# Altium project CONTROLLER_30.PrjPcb (part 3 of 3)
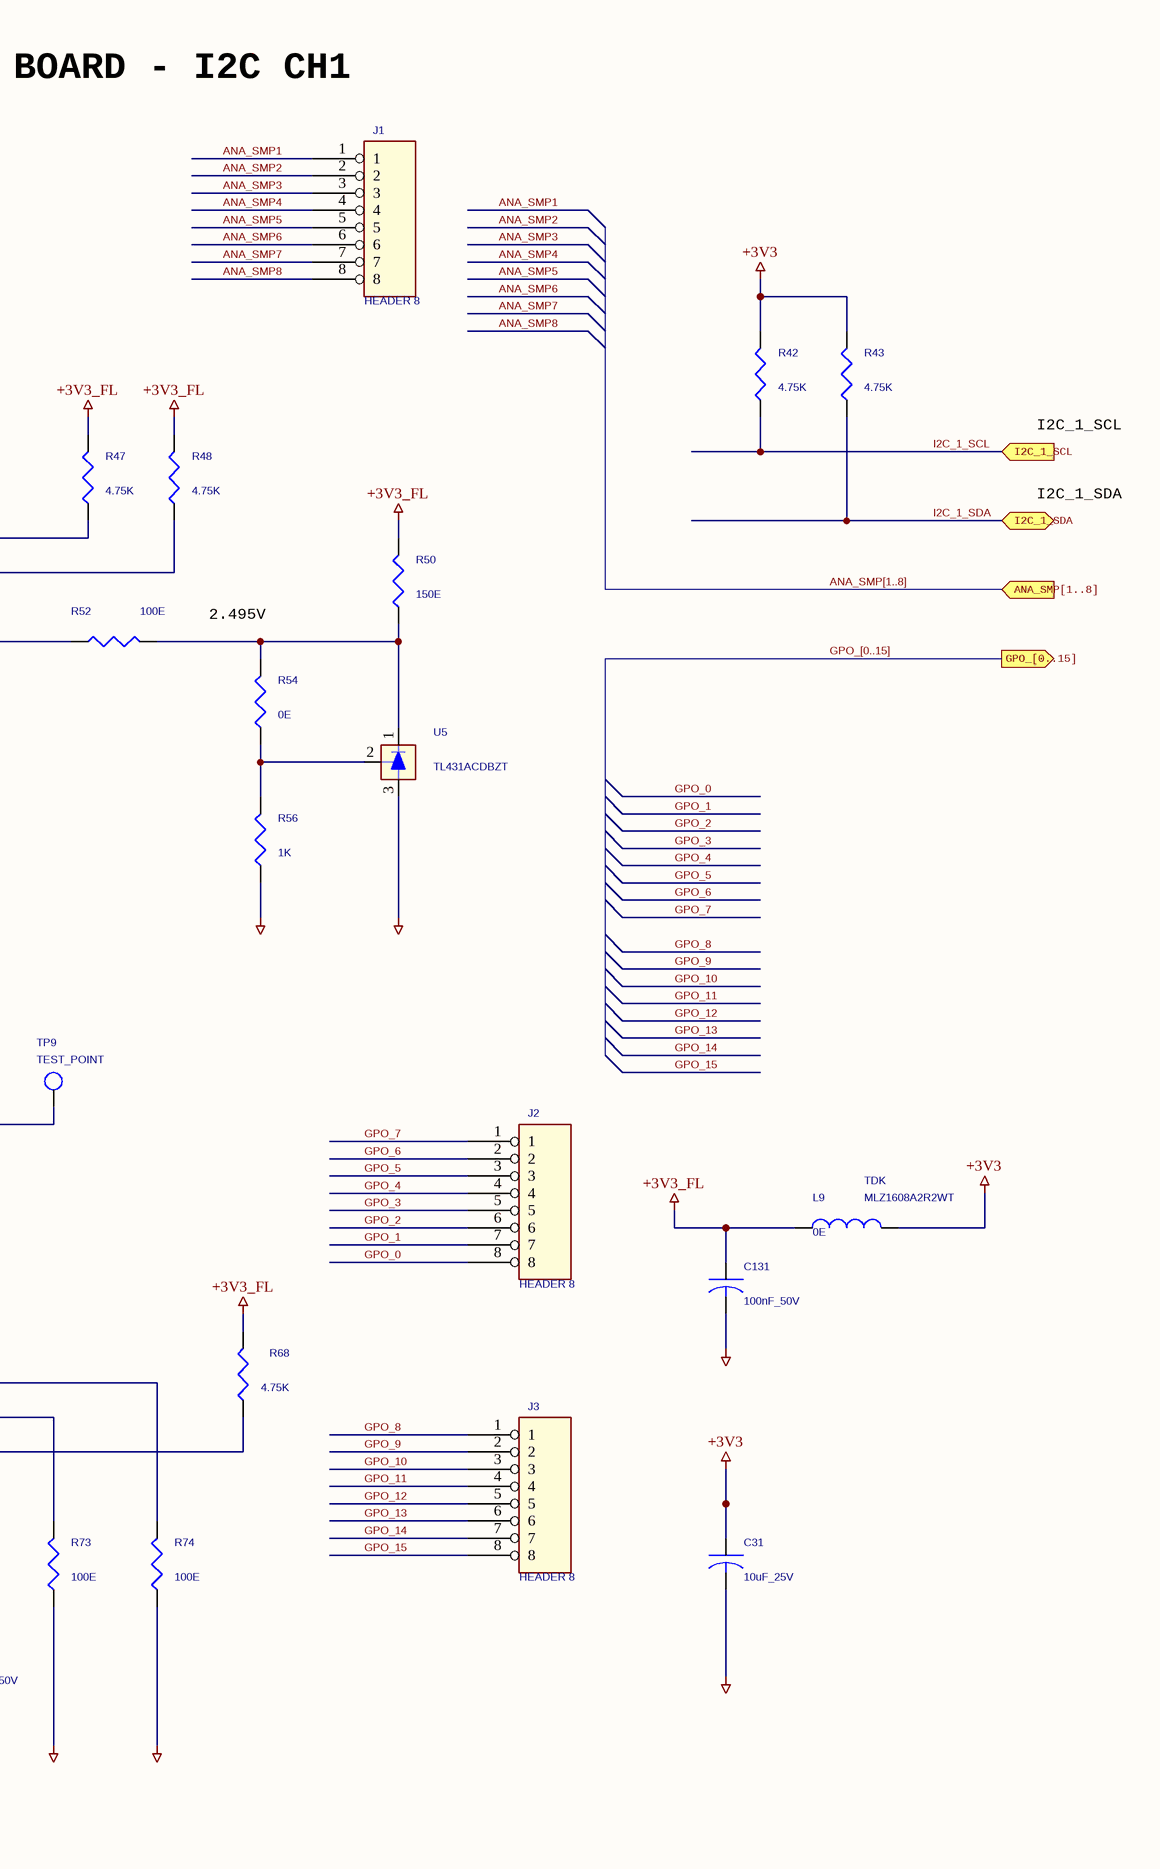
[diagram p22: I2C_CH1.SchDoc, right]

## Nets that join several sheets
+3V3: USB (7 pins), LED_DRIVE (8 pins), PIC_MAIN (R281.1 R282.1), PIC_RS232 (C79.1 C80.1 U16.16), PIC_CONTROLLER (8 pins), PIC_POWER_MISC (43 pins), ANALOG_INPUT (C1.1 C2.1 U2.4 U3.4), POWER (14 pins), I2C_CH2 (17 pins), I2C_CH3 (35 pins), INT_CONN (P1.4A P1.4B P1.4C P1.4D), I2C_CH1 (C31.1 L9.2 R42.2 R43.2)
+5V: USB (R343.1 R381.1 R382.1), PIC_CONTROLLER (R270.1), POWER (18 pins), INT_CONN (P1.3A P1.3B P1.3C P1.3D)
+12V: PIC_CONTROLLER (R268.1), POWER (7 pins), INT_CONN (P1.2A P1.2B P1.2C P1.2D)
AGND: ANALOG_INPUT (36 pins), POWER (R336.1)
GND_CPU: USB (31 pins), LED_DRIVE (22 pins), PIC_MAIN (7 pins), PIC_RS232 (5 pins), PIC_CONTROLLER (5 pins), PIC_POWER_MISC (47 pins), POWER (28 pins), I2C_CH2 (30 pins), I2C_CH3 (13 pins), I2C_CH1 (16 pins)
3V3_SMP: POWER (R386.2), INT_CONN (P1.45B)
5V_SMP: POWER (R385.2), INT_CONN (P1.46B)
ANA_IN_1: ANALOG_INPUT (C5.1 R3.1 R8.1 R388.2), INT_CONN (P1.7B)
ANA_IN_2: ANALOG_INPUT (C10.1 R13.1 R18.1 R389.2), INT_CONN (P1.8B)
ANA_IN_3: ANALOG_INPUT (C17.1 R23.1 R28.1 R390.2), INT_CONN (P1.9B)
ANA_IN_4: ANALOG_INPUT (C22.1 R33.1 R38.1 R391.2), INT_CONN (P1.10B)
ANA_IN_5: ANALOG_INPUT (C3.1 R1.1 R5.1 R392.2), INT_CONN (P1.11B)
ANA_IN_6: ANALOG_INPUT (C9.1 R11.1 R15.1 R393.2), INT_CONN (P1.12B)
ANA_IN_7: ANALOG_INPUT (C15.1 R21.1 R25.1 R394.2), INT_CONN (P1.13B)
ANA_IN_8: ANALOG_INPUT (C21.1 R31.1 R35.1 R395.2), INT_CONN (P1.14B)
ANA_SMP1: INT_CONN (P1.21B), I2C_CH1 (J1.1 R41.2)
ANA_SMP2: INT_CONN (P1.22B), I2C_CH1 (J1.2 R44.2)
ANA_SMP3: INT_CONN (P1.23B), I2C_CH1 (J1.3 R45.2)
ANA_SMP4: INT_CONN (P1.24B), I2C_CH1 (J1.4 R46.2)
ANA_SMP5: INT_CONN (P1.25B), I2C_CH1 (J1.5 R49.2)
ANA_SMP6: INT_CONN (P1.26B), I2C_CH1 (J1.6 R51.2)
ANA_SMP7: INT_CONN (P1.27B), I2C_CH1 (J1.7 R53.2)
ANA_SMP8: INT_CONN (P1.28B), I2C_CH1 (J1.8 R55.2)
ANALOG_IN0: PIC_CONTROLLER (R210.2), INT_CONN (P1.15B)
ANALOG_IN1: PIC_CONTROLLER (R212.2), INT_CONN (P1.16B)
ANALOG_IN2: PIC_CONTROLLER (R220.2), INT_CONN (P1.17B)
ANALOG_IN3: PIC_CONTROLLER (R215.2), INT_CONN (P1.18B)
ANALOG_IN4: PIC_CONTROLLER (R217.2), INT_CONN (P1.19B)
ANALOG_IN5: PIC_CONTROLLER (R218.2), INT_CONN (P1.20B)
ANI_IN1: I2C_CH2 (J4.1 R79.2), INT_CONN (P1.29B)
ANI_IN2: I2C_CH2 (J4.2 R78.2), INT_CONN (P1.30B)
ANI_IN3: I2C_CH2 (J4.3 R80.2), INT_CONN (P1.31B)
ANI_IN4: I2C_CH2 (J4.4 R81.2), INT_CONN (P1.32B)
ANI_IN5: I2C_CH2 (J4.5 R83.2), INT_CONN (P1.33B)
ANI_IN6: I2C_CH2 (J4.6 R82.2), INT_CONN (P1.34B)
ANI_IN7: I2C_CH2 (J4.7 R84.2), INT_CONN (P1.35B)
ANI_IN8: I2C_CH2 (J4.8 R86.2), INT_CONN (P1.36B)
ANI_IN9: I2C_CH2 (J5.1 R87.2), INT_CONN (P1.37B)
ANI_IN10: I2C_CH2 (J5.2 R88.2), INT_CONN (P1.38B)
ANI_IN11: I2C_CH2 (J5.3 R89.2), INT_CONN (P1.39B)
ANI_IN12: I2C_CH2 (J5.4 R93.2), INT_CONN (P1.40B)
ANI_IN13: I2C_CH2 (J5.5 R94.2), INT_CONN (P1.41B)
ANI_IN14: I2C_CH2 (J5.6 R95.2), INT_CONN (P1.42B)
ANI_IN15: I2C_CH2 (J5.7 R96.2), INT_CONN (P1.43B)
ANI_IN16: I2C_CH2 (J5.8 R97.2), INT_CONN (P1.44B)
DEB_RS232_RX: PIC_RS232 (J17.3 R322.1 R323.1 TP34.1), INT_CONN (P1.9A)
DEB_RS232_TX: PIC_RS232 (J17.2 R318.1 R324.1 TP33.1), INT_CONN (P1.8A)
DEB_USB_DN: USB (5 pins), INT_CONN (P1.50B)
DEB_USB_DP: USB (5 pins), INT_CONN (P1.49B)
DIG_IN_10: I2C_CH3 (J9.1 R146.2 U12.4), INT_CONN (P1.19C)
DIG_IN_11: I2C_CH3 (J9.2 R145.2 U12.5), INT_CONN (P1.20C)
DIG_IN_12: I2C_CH3 (J9.3 R144.2 U12.6), INT_CONN (P1.21C)
DIG_IN_13: I2C_CH3 (J9.4 R143.2 U12.7), INT_CONN (P1.22C)
DIG_IN_14: I2C_CH3 (J9.5 R142.2 U12.9), INT_CONN (P1.23C)
DIG_IN_15: I2C_CH3 (J9.6 R141.2 U12.10), INT_CONN (P1.24C)
DIG_IN_16: I2C_CH3 (J9.7 R140.2 U12.11), INT_CONN (P1.25C)
DIG_IN_17: I2C_CH3 (J9.8 R139.2 U12.12), INT_CONN (P1.26C)
DIG_IN_20: I2C_CH3 (J10.1 R157.2 U13.4), INT_CONN (P1.27C)
DIG_IN_21: I2C_CH3 (J10.2 R156.2 U13.5), INT_CONN (P1.28C)
DIG_IN_22: I2C_CH3 (J10.3 R155.2 U13.6), INT_CONN (P1.29C)
DIG_IN_23: I2C_CH3 (J10.4 R154.2 U13.7), INT_CONN (P1.30C)
DIG_IN_24: I2C_CH3 (J10.5 R153.2 U13.9), INT_CONN (P1.31C)
DIG_IN_25: I2C_CH3 (J10.6 R152.2 U13.10), INT_CONN (P1.32C)
DIG_IN_26: I2C_CH3 (J10.7 R151.2 U13.11), INT_CONN (P1.33C)
DIG_IN_27: I2C_CH3 (J10.8 R150.2 U13.12), INT_CONN (P1.34C)
DIG_IN_30: I2C_CH3 (J11.1 R170.2 U14.4), INT_CONN (P1.35C)
DIG_IN_31: I2C_CH3 (J11.2 R169.2 U14.5), INT_CONN (P1.36C)
DIG_IN_32: I2C_CH3 (J11.3 R168.2 U14.6), INT_CONN (P1.37C)
DIG_IN_33: I2C_CH3 (J11.4 R167.2 U14.7), INT_CONN (P1.38C)
DIG_IN_34: I2C_CH3 (J11.5 R166.2 U14.9), INT_CONN (P1.39C)
DIG_IN_35: I2C_CH3 (J11.6 R165.2 U14.10), INT_CONN (P1.40C)
DIG_IN_36: I2C_CH3 (J11.7 R164.2 U14.11), INT_CONN (P1.41C)
DIG_IN_37: I2C_CH3 (J11.8 R163.2 U14.12), INT_CONN (P1.42C)
DNI_GP0: I2C_CH2 (J6.1 R105.2), INT_CONN (P1.6D)
DNI_GP1: I2C_CH2 (J6.2 R109.2), INT_CONN (P1.7D)
DNI_GP2: I2C_CH2 (J6.3 R110.2), INT_CONN (P1.8D)
DNI_GP3: I2C_CH2 (J6.4 R111.2), INT_CONN (P1.9D)
DNI_GP4: I2C_CH2 (J6.5 R113.2), INT_CONN (P1.10D)
DNI_GP5: I2C_CH2 (J6.6 R112.2), INT_CONN (P1.11D)
DNI_GP6: I2C_CH2 (J6.7 R115.2), INT_CONN (P1.12D)
DNI_GP7: I2C_CH2 (J6.8 R117.2), INT_CONN (P1.13D)
DNI_GP8: I2C_CH2 (J7.1 R119.2), INT_CONN (P1.14D)
DNI_GP9: I2C_CH2 (J7.2 R122.2), INT_CONN (P1.15D)
DNI_GP10: I2C_CH2 (J7.3 R124.2), INT_CONN (P1.16D)
DNI_GP11: I2C_CH2 (J7.4 R126.2), INT_CONN (P1.17D)
DNI_GP12: I2C_CH2 (J7.5 R133.2), INT_CONN (P1.18D)
DNI_GP13: I2C_CH2 (J7.6 R135.2), INT_CONN (P1.19D)
DNI_GP14: I2C_CH2 (J7.7 R136.2), INT_CONN (P1.20D)
DNI_GP15: I2C_CH2 (J7.8 R138.2), INT_CONN (P1.21D)
GLOBAL_RESET: PIC_POWER_MISC (R293.2), INT_CONN (P1.38A TP16.1)
GPO_0: INT_CONN (P1.22D), I2C_CH1 (J2.8 R57.2)
GPO_1: INT_CONN (P1.23D), I2C_CH1 (J2.7 R58.2)
GPO_2: INT_CONN (P1.24D), I2C_CH1 (J2.6 R59.2)
GPO_3: INT_CONN (P1.25D), I2C_CH1 (J2.5 R60.2)
GPO_4: INT_CONN (P1.26D), I2C_CH1 (J2.4 R62.2)
GPO_5: INT_CONN (P1.27D), I2C_CH1 (J2.3 R64.2)
GPO_6: INT_CONN (P1.28D), I2C_CH1 (J2.2 R63.2)
GPO_7: INT_CONN (P1.29D), I2C_CH1 (J2.1 R65.2)
GPO_8: INT_CONN (P1.30D), I2C_CH1 (J3.1 R66.2)
GPO_9: INT_CONN (P1.31D), I2C_CH1 (J3.2 R67.2)
GPO_10: INT_CONN (P1.32D), I2C_CH1 (J3.3 R69.2)
GPO_11: INT_CONN (P1.33D), I2C_CH1 (J3.4 R70.2)
GPO_12: INT_CONN (P1.34D), I2C_CH1 (J3.5 R71.2)
GPO_13: INT_CONN (P1.35D), I2C_CH1 (J3.6 R75.2)
GPO_14: INT_CONN (P1.36D), I2C_CH1 (J3.7 R76.2)
GPO_15: INT_CONN (P1.37D), I2C_CH1 (J3.8 R77.2)
I2C_1_SCL: LED_DRIVE (R188.2 U15.14), PIC_POWER_MISC (R294.2), I2C_CH3 (R158.2 U12.14 U13.14 U14.14), INT_CONN (P1.47A), I2C_CH1 (R42.1 U4.14 U6.14)
I2C_1_SDA: LED_DRIVE (R187.2 U15.15), PIC_POWER_MISC (R295.2), I2C_CH3 (R159.2 U12.15 U13.15 U14.15), INT_CONN (P1.48A), I2C_CH1 (R43.1 U4.15 U6.15)
I2C_2_SCL: PIC_POWER_MISC (R296.2), I2C_CH2 (5 pins), INT_CONN (P1.49A)
I2C_2_SDA: PIC_POWER_MISC (R297.2), I2C_CH2 (5 pins), INT_CONN (P1.50A)
LED_DRV_1: LED_DRIVE (R174.2), INT_CONN (P1.11C)
LED_DRV_2: LED_DRIVE (R177.2), INT_CONN (P1.12C)
LED_DRV_3: LED_DRIVE (R180.2), INT_CONN (P1.13C)
LED_DRV_4: LED_DRIVE (R183.2), INT_CONN (P1.14C)
LED_DRV_5: LED_DRIVE (R191.2), INT_CONN (P1.15C)
LED_DRV_6: LED_DRIVE (R197.2), INT_CONN (P1.16C)
LED_DRV_7: LED_DRIVE (R202.2), INT_CONN (P1.17C)
LED_DRV_8: LED_DRIVE (R203.2), INT_CONN (P1.18C)
PIC_ITERRUPT0: PIC_CONTROLLER (R253.2), INT_CONN (P1.6C)
PIC_ITERRUPT1: PIC_CONTROLLER (R256.2), INT_CONN (P1.7C)
PIC_ITERRUPT2: PIC_CONTROLLER (R258.2), INT_CONN (P1.8C)
PIC_ITERRUPT3: PIC_CONTROLLER (R260.2), INT_CONN (P1.9C)
PIC_ITERRUPT4: PIC_CONTROLLER (R261.2), INT_CONN (P1.10C)
PIC_RTCC: PIC_POWER_MISC (R292.2), INT_CONN (P1.37A TP15.1)
RA3: PIC_CONTROLLER (R244.2), INT_CONN (P1.25A)
RA6: PIC_CONTROLLER (R249.1), INT_CONN (P1.26A)
RA7: PIC_CONTROLLER (R255.1), INT_CONN (P1.27A)
RA14: PIC_MAIN (R284.2), PIC_CONTROLLER (R246.2), INT_CONN (P1.35A TP13.1)
RA15: PIC_MAIN (R285.2), PIC_CONTROLLER (R248.2), INT_CONN (P1.36A TP14.1)
RD0: PIC_CONTROLLER (R242.2), INT_CONN (P1.29A)
RD1: PIC_CONTROLLER (R209.1), INT_CONN (P1.10A)
RD2: PIC_CONTROLLER (R211.1), INT_CONN (P1.11A)
RD3: PIC_CONTROLLER (R213.1), INT_CONN (P1.12A)
RD4: PIC_CONTROLLER (R214.1), INT_CONN (P1.13A)
RD5: PIC_CONTROLLER (R216.1), INT_CONN (P1.14A)
RD6: PIC_CONTROLLER (R221.1), INT_CONN (P1.15A)
RD7: PIC_CONTROLLER (R222.1), INT_CONN (P1.16A)
RD11: PIC_CONTROLLER (R225.1), INT_CONN (P1.17A)
RD12: PIC_CONTROLLER (R227.1), INT_CONN (P1.18A)
RD13: PIC_CONTROLLER (R229.1), INT_CONN (P1.19A)
RD14: PIC_CONTROLLER (R231.1), INT_CONN (P1.20A)
RD15: PIC_CONTROLLER (R233.1), INT_CONN (P1.21A)
RE1: PIC_CONTROLLER (R237.1), INT_CONN (P1.30A)
RE3: PIC_CONTROLLER (R235.1), INT_CONN (P1.31A)
RE8: PIC_CONTROLLER (R241.1), INT_CONN (P1.33A)
RE9: PIC_CONTROLLER (R243.1), INT_CONN (P1.34A)
RESET: PIC_MAIN (R283.2), PIC_POWER_MISC (R291.2)
RF0: PIC_CONTROLLER (R245.1), PIC_POWER_MISC (U26.4), INT_CONN (P1.22A)
RF1: PIC_CONTROLLER (R247.1), INT_CONN (P1.23A)
RF3: PIC_CONTROLLER (R251.1), INT_CONN (P1.24A)
RG0: PIC_CONTROLLER (R239.2), INT_CONN (P1.28A)
SBC_RS232_RX: PIC_RS232 (J16.3 R313.1 R320.1 TP30.1), INT_CONN (P1.7A)
SBC_RS232_TX: PIC_RS232 (J16.2 R314.1 R316.1 TP29.1), INT_CONN (P1.6A)
SBC_USB_DN: USB (5 pins), INT_CONN (P1.48B)
SBC_USB_DP: USB (5 pins), INT_CONN (P1.47B)
SPI_1_SCK: PIC_POWER_MISC (R369.2 R375.2), INT_CONN (P1.47D)
SPI_1_SCS: PIC_POWER_MISC (R372.2 R376.2 R387.2), INT_CONN (P1.50D)
SPI_1_SDI: PIC_POWER_MISC (R370.2 R374.2), INT_CONN (P1.48D)
SPI_1_SDO: PIC_POWER_MISC (R371.2 R377.2), INT_CONN (P1.49D)
SPI_2_SCK: PIC_POWER_MISC (R300.2), INT_CONN (P1.39A)
SPI_2_SCS: PIC_POWER_MISC (R303.2 R397.2), INT_CONN (P1.42A)
SPI_2_SDI: PIC_POWER_MISC (R301.2), INT_CONN (P1.40A)
SPI_2_SDO: PIC_POWER_MISC (R302.2), INT_CONN (P1.41A)
SPI_3_SCK: PIC_POWER_MISC (R304.2), INT_CONN (P1.43A)
SPI_3_SCS: PIC_POWER_MISC (R307.2 R396.2), INT_CONN (P1.46A)
SPI_3_SDI: PIC_POWER_MISC (R305.2), INT_CONN (P1.44A)
SPI_3_SDO: PIC_POWER_MISC (R306.2), INT_CONN (P1.45A)
U3_RS232_RX: USB (R354.2 TP62.1 U22.7), PIC_RS232 (R364.1)
U3_RS232_TX: USB (R355.2 TP61.1 U22.10), PIC_RS232 (R363.1)
U4_RS232_RX: USB (R349.2 TP57.1 U20.7), PIC_RS232 (R362.1)
U4_RS232_TX: USB (R350.2 TP56.1 U20.10), PIC_RS232 (R361.1)
UART1_RX: PIC_CONTROLLER (R366.2), INT_CONN (P1.44D)
UART1_TX: PIC_CONTROLLER (R365.2), INT_CONN (P1.43D)
UART2_RX: PIC_MAIN (J12.1 TP25.1), PIC_CONTROLLER (R368.2), INT_CONN (P1.46D)
UART2_TX: PIC_MAIN (J12.2 TP26.1), PIC_CONTROLLER (R367.2), INT_CONN (P1.45D)
UART3_RX: PIC_RS232 (R321.2 R323.2 R364.2 TP32.1), PIC_POWER_MISC (R310.2)
UART3_TX: PIC_RS232 (R317.2 R324.2 R363.2 TP31.1), PIC_POWER_MISC (R308.2)
UART4_RX: PIC_RS232 (R313.2 R319.2 R362.2 TP28.1), PIC_POWER_MISC (R312.2)
UART4_TX: PIC_RS232 (R314.2 R315.2 R361.2 TP27.1), PIC_POWER_MISC (R311.2)
USB_D+: USB (R344.2 R346.1 TP46.1), PIC_CONTROLLER (R298.1)
USB_D-: USB (R345.2 R347.1 TP47.1), PIC_CONTROLLER (R299.1)
USB_DET: USB (R380.1 TP52.1), PIC_POWER_MISC (R309.1)
USB_ID: USB (J18.4 TP51.1 U19.6), PIC_CONTROLLER (R252.1)
VREF_1: I2C_CH2 (J8.1 R114.1), INT_CONN (P1.43C)
VREF_2: I2C_CH2 (J8.2 R116.1), INT_CONN (P1.44C)
VREF_3: I2C_CH2 (J8.3 R118.1), INT_CONN (P1.45C)
VREF_4: I2C_CH2 (J8.4 R121.1), INT_CONN (P1.46C)
VREF_5: I2C_CH2 (J8.5 R123.1), INT_CONN (P1.47C)
VREF_6: I2C_CH2 (J8.6 R125.1), INT_CONN (P1.48C)
VREF_7: I2C_CH2 (J8.7 R132.1), INT_CONN (P1.49C)
VREF_8: I2C_CH2 (J8.8 R134.1), INT_CONN (P1.50C)

## Assembly variants
Variant of CONTROLLER_30: not fitted R42 R43 R100 R101 R158 R159 R187 R188 R206 R313 R314 R317 R321 R323 R324 R361 R362 R373 U26